# Altium project PCB_Project.PrjPcb
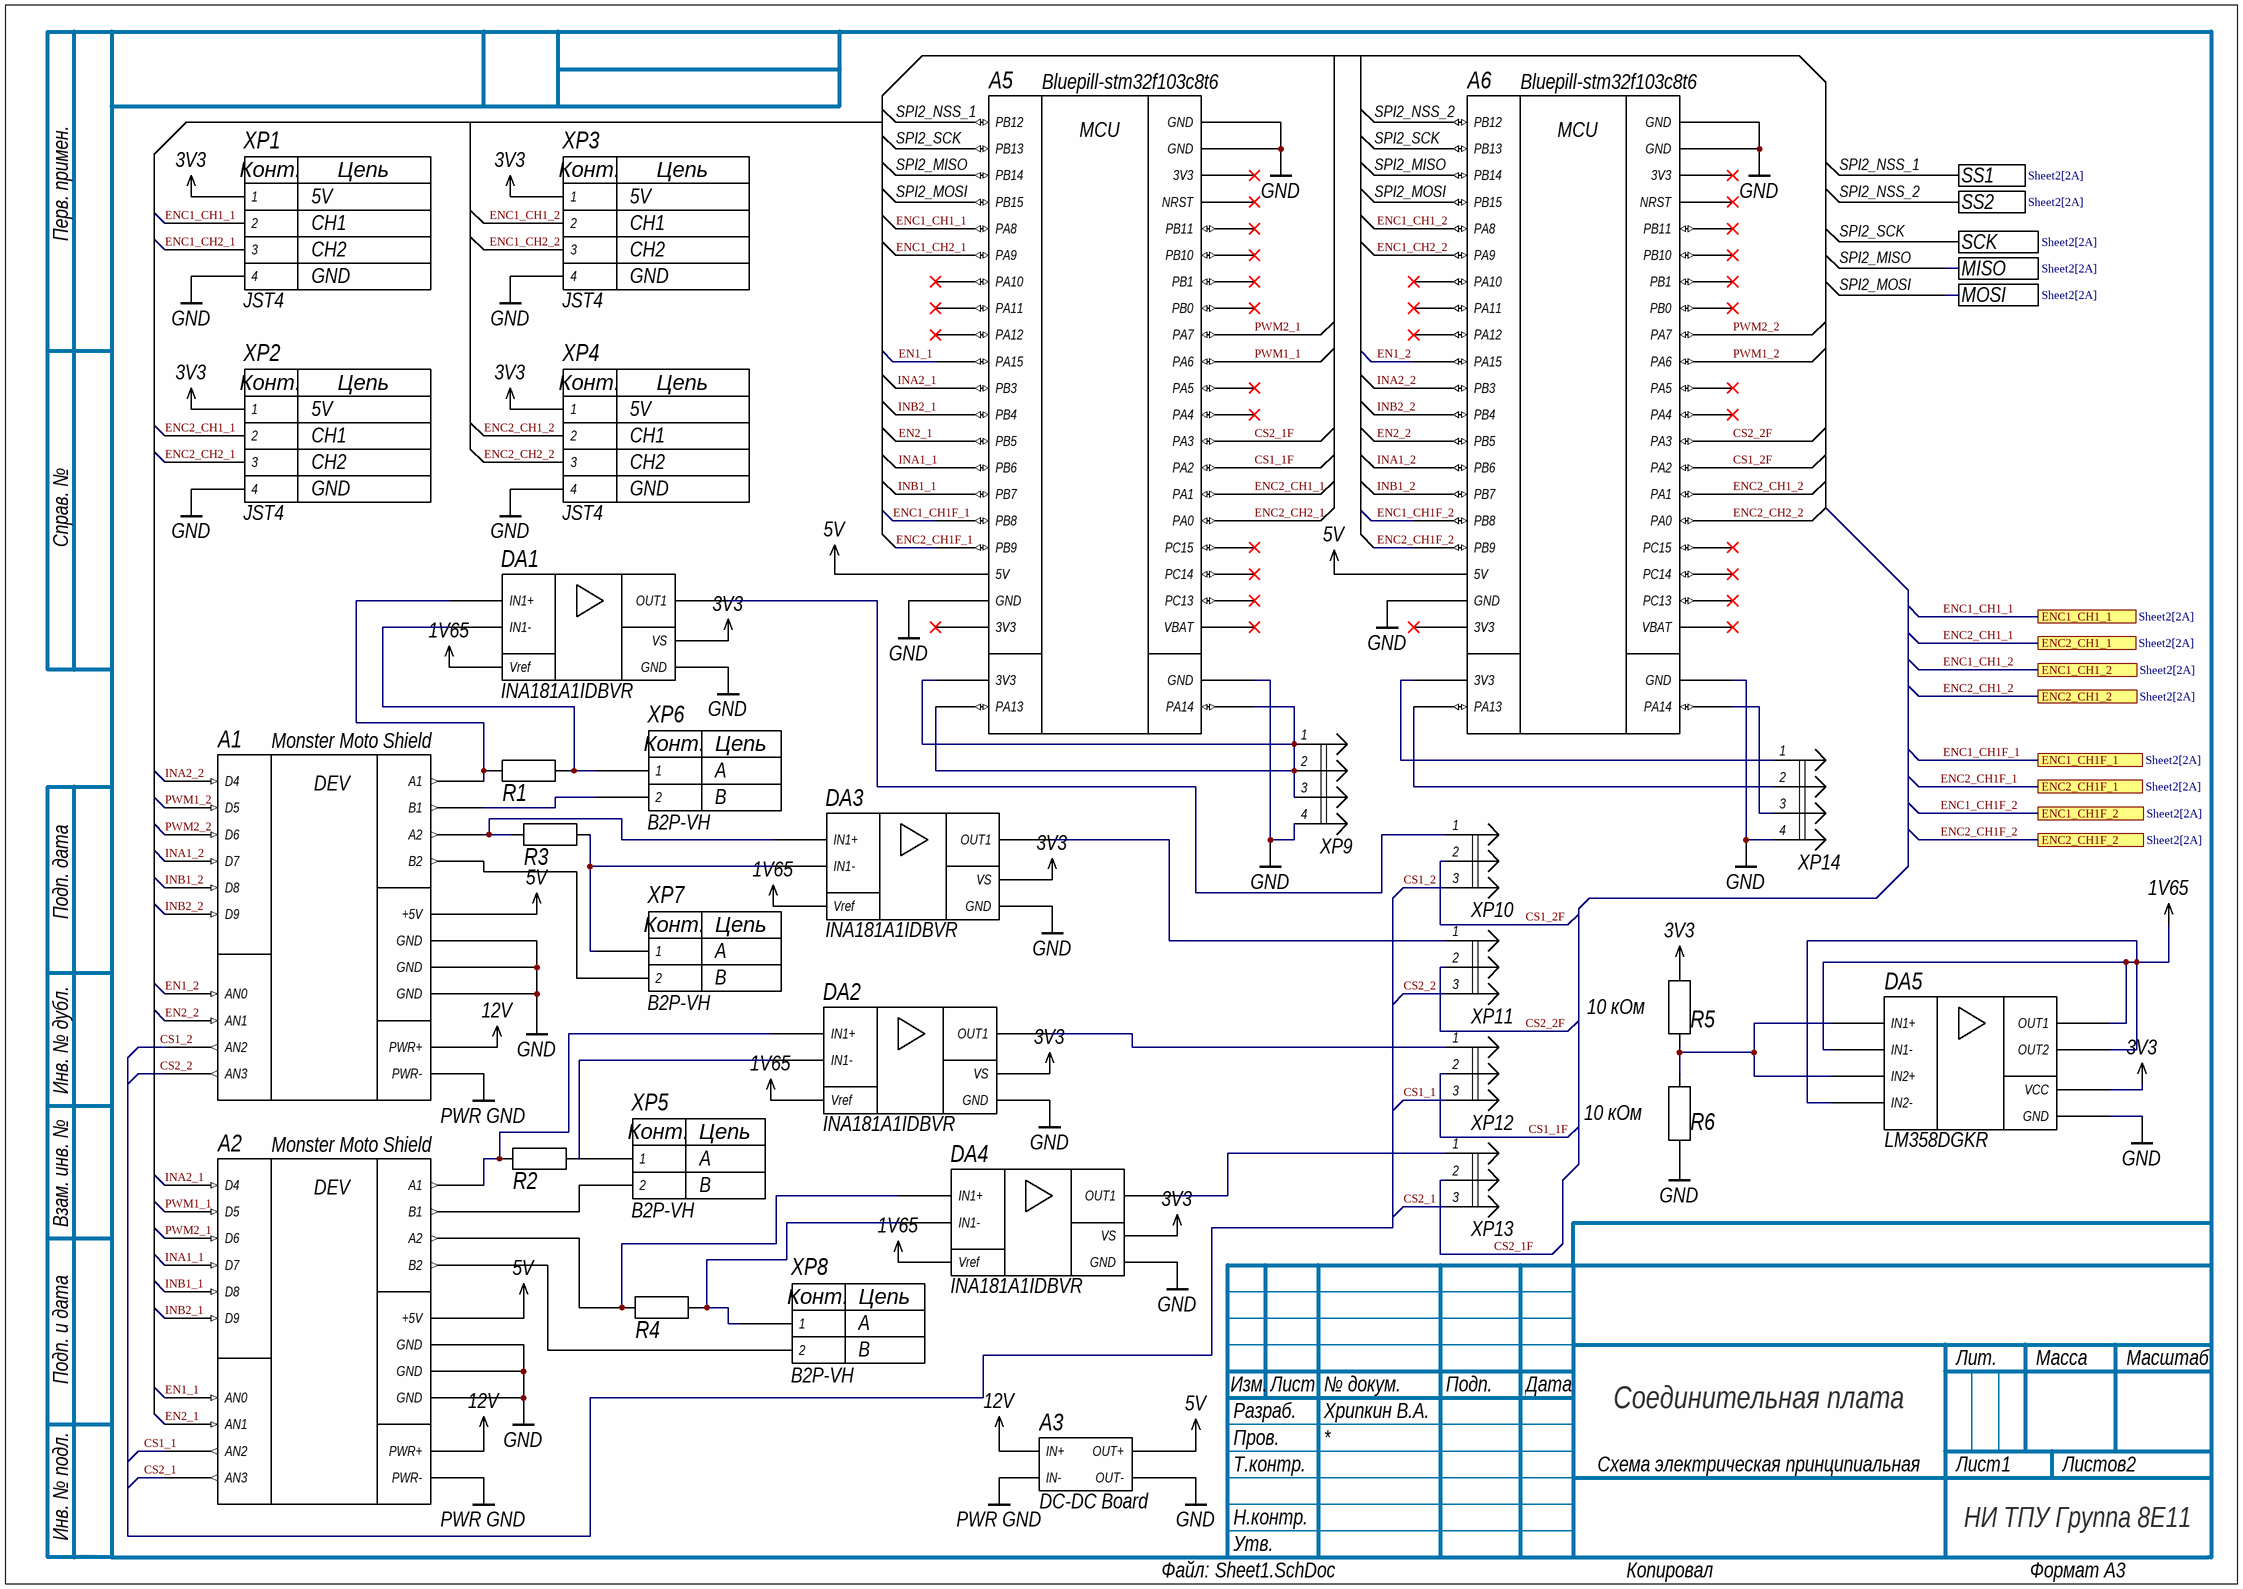
[diagram p0: Sheet1.SchDoc]
2 sheets, 62 parts. Net scope: flat (ports and power ports of the same name join across sheets).
Board file: PCB1.PcbDoc
Sheets:
  Sheet1.SchDoc
  Sheet2.SchDoc

## Sheet Sheet1.SchDoc
size 420 x 297 mm; Author: ALTIUM GOSTBOM2.0 KEV; SheetNumber: 1; SheetTotal: 2; п_Разраб_Р: Хрипкин В.А.; Наименование_организации: НИ ТПУ Группа 8Е11; Наименование2: Соединительная плата; Вид_документа_SCH: Схема электрическая принципиальная

### Parts
A1  Monster Moto Shield  [Monster Moto Shield]
A2  Monster Moto Shield  [Monster Moto Shield]
A3  DC-DC Board  [DC-DC Board]
A5  Bluepill-stm32f103c8t6  [BluePill]
A6  Bluepill-stm32f103c8t6  [BluePill]
DA1  INA181A1IDBVR  [SOT236]
DA2  INA181A1IDBVR  [SOT236]
DA3  INA181A1IDBVR  [SOT236]
DA4  INA181A1IDBVR  [SOT236]
DA5  LM358DGKR  [VSSOP-8]
R1  ва  [R1210]  (value not drawn)
R2  ва  [R1210]  (value not drawn)
R3  ва  [R1210]  (value not drawn)
R4  ва  [R1210]  (value not drawn)
R5  ва  [R0603]  (value not drawn)
R6  ва  [R0603]  (value not drawn)
XP1  JST4  [JST 4pin]
XP2  JST4  [JST 4pin]
XP3  JST4  [JST 4pin]
XP4  JST4  [JST 4pin]
XP5  B2P-VH  [B2P-VH]
XP6  B2P-VH  [B2P-VH]
XP7  B2P-VH  [B2P-VH]
XP8  B2P-VH  [B2P-VH]
XP9  (no value)  [PLS-4]
XP10  (no value)  [PLS-3]
XP11  (no value)  [PLS-3]
XP12  (no value)  [PLS-3]
XP13  (no value)  [PLS-3]
XP14  (no value)  [PLS-4]

### Ports
ENC1_CH1_1 (see Sheet2[2A]), ENC1_CH1_2 (see Sheet2[2A]), ENC1_CH1F_1 (see Sheet2[2A]), ENC1_CH1F_2 (see Sheet2[2A]), ENC2_CH1_1 (see Sheet2[2A]), ENC2_CH1_2 (see Sheet2[2A]), ENC2_CH1F_1 (see Sheet2[2A]), ENC2_CH1F_2 (see Sheet2[2A]), MISO (see Sheet2[2A]), MOSI (see Sheet2[2A]), SCK (see Sheet2[2A]), SS1 (see Sheet2[2A]), SS2 (see Sheet2[2A])

### Nets
1V65: DA1.1(Vref) DA2.1(Vref) DA3.1(Vref) DA4.1(Vref) DA5.1(OUT1) DA5.2(IN1-) DA5.6(IN2-) DA5.7(OUT2)
3V3: DA1.3(VS) DA2.3(VS) DA3.3(VS) DA4.3(VS) DA5.8(VCC) R5.2 XP1.1 XP2.1 XP3.1 XP4.1
5V: A1.19(+5V) A2.19(+5V) A3.3(OUT+) A5.18(5V) A6.18(5V)
12V: A1.20(PWR+) A2.20(PWR+) A3.1(IN+)
GND: A1.16(GND) A1.17(GND) A1.18(GND) A2.16(GND) A2.17(GND) A2.18(GND) A3.4(OUT-) A5.19(GND) A5.21(GND) A5.22(GND) A5.44(GND) A6.19(GND) A6.21(GND) A6.22(GND) A6.44(GND) DA1.2(GND) DA2.2(GND) DA3.2(GND) DA4.2(GND) DA5.4(GND) R6.1 XP1.4 XP2.4 XP3.4 XP4.4 XP9.4 XP14.4
PWR GND: A1.21(PWR-) A2.21(PWR-) A3.2(IN-)
CS1_1: A2.3(AN2) XP12.3
CS1_1F: A5.34(PA2) XP12.2
CS1_2: A1.3(AN2) XP10.3
CS1_2F: A6.34(PA2) XP10.2
CS2_1: A2.4(AN3) XP13.3
CS2_1F: A5.33(PA3) XP13.2
CS2_2: A1.4(AN3) XP11.3
CS2_2F: A6.33(PA3) XP11.2
EN1_1: A2.1(AN0) A5.10(PA15)
EN1_2: A1.1(AN0) A6.10(PA15)
EN2_1: A2.2(AN1) A5.13(PB5)
EN2_2: A1.2(AN1) A6.13(PB5)
ENC1_CH1_1: A5.5(PA8) XP1.2 ; port ENC1_CH1_1
ENC1_CH1_2: A6.5(PA8) XP3.2 ; port ENC1_CH1_2
ENC1_CH1F_1: A5.16(PB8) ; port ENC1_CH1F_1
ENC1_CH1F_2: A6.16(PB8) ; port ENC1_CH1F_2
ENC1_CH2_1: A5.6(PA9) XP1.3
ENC1_CH2_2: A6.6(PA9) XP3.3
ENC2_CH1_1: A5.35(PA1) XP2.2 ; port ENC2_CH1_1
ENC2_CH1_2: A6.35(PA1) XP4.2 ; port ENC2_CH1_2
ENC2_CH1F_1: A5.17(PB9) ; port ENC2_CH1F_1
ENC2_CH1F_2: A6.17(PB9) ; port ENC2_CH1F_2
ENC2_CH2_1: A5.36(PA0) XP2.3
ENC2_CH2_2: A6.36(PA0) XP4.3
INA1_1: A2.8(D7) A5.14(PB6)
INA1_2: A1.8(D7) A6.14(PB6)
INA2_1: A2.5(D4) A5.11(PB3)
INA2_2: A1.5(D4) A6.11(PB3)
INB1_1: A2.9(D8) A5.15(PB7)
INB1_2: A1.9(D8) A6.15(PB7)
INB2_1: A2.10(D9) A5.12(PB4)
INB2_2: A1.10(D9) A6.12(PB4)
PWM1_1: A2.6(D5) A5.30(PA6)
PWM1_2: A1.6(D5) A6.30(PA6)
PWM2_1: A2.7(D6) A5.29(PA7)
PWM2_2: A1.7(D6) A6.29(PA7)
SPI2_MISO: A5.3(PB14) A6.3(PB14) ; port MISO
SPI2_MOSI: A5.4(PB15) A6.4(PB15) ; port MOSI
SPI2_NSS_1: A5.1(PB12) ; port SS1
SPI2_NSS_2: A6.1(PB12) ; port SS2
SPI2_SCK: A5.2(PB13) A6.2(PB13) ; port SCK
NetA1_11: A1.11(A1) DA1.4(IN1+) R1.2
NetA1_12: A1.12(B1) XP6.2
NetA1_13: A1.13(A2) DA3.4(IN1+) R3.2
NetA1_14: A1.14(B2) XP7.2
NetA2_11: A2.11(A1) DA2.4(IN1+) R2.2
NetA2_12: A2.12(B1) XP5.2
NetA2_13: A2.13(A2) DA4.4(IN1+) R4.2
NetA2_14: A2.14(B2) XP8.2
NetA5_41: A5.41(3V3) A5.42(PA13) A5.43(PA14) XP9.1 XP9.2 XP9.3
NetA6_41: A6.41(3V3) XP14.1
NetA6_42: A6.42(PA13) XP14.2
NetA6_43: A6.43(PA14) XP14.3
NetDA1_5: DA1.5(IN1-) R1.1 XP6.1
NetDA1_6: DA1.6(OUT1) XP10.1
NetDA2_5: DA2.5(IN1-) R2.1 XP5.1
NetDA2_6: DA2.6(OUT1) XP12.1
NetDA3_5: DA3.5(IN1-) R3.1 XP7.1
NetDA3_6: DA3.6(OUT1) XP11.1
NetDA4_5: DA4.5(IN1-) R4.1 XP8.1
NetDA4_6: DA4.6(OUT1) XP13.1
NetDA5_3: DA5.3(IN1+) DA5.5(IN2+) R5.1 R6.2

Not connected (* = marked no-connect by the designer): A5 7(PA10)* 8(PA11)* 9(PA12)* 20(3V3)* 23(3V3)* 24(NRST)* 25(PB11)* 26(PB10)* 27(PB1)* 28(PB0)* 31(PA5)* 32(PA4)* 37(PC15)* 38(PC14)* 39(PC13)* 40(VBAT)*; A6 7(PA10)* 8(PA11)* 9(PA12)* 20(3V3)* 23(3V3)* 24(NRST)* 25(PB11)* 26(PB10)* 27(PB1)* 28(PB0)* 31(PA5)* 32(PA4)* 37(PC15)* 38(PC14)* 39(PC13)* 40(VBAT)*

### Notes on the sheet
- (near R5) 10 кОм
- (near R6) 10 кОм
- Перв. примен.
- Справ. №
- Подп. дата
- Инв. № дубл.
- Взам. инв. №
- Подп. и дата
- Изм.
- Разраб.
- Лист
- № докум.
- Подп.
- Дата
- Лит.
- Масса
- Масштаб
- Пров.
- Т.контр.
- Листов
- Инв. № подл.
- Н.контр.
- Утв.
- ALTIUM GOSTBOM2.0 KEV
- Файл:
- Копировал
- Формат А3
- (in symbol BluePill) MCU
- (in symbol JST4) Конт.; Цепь; 5V; CH1; CH2; GND
- (in symbol JST VH(B2P-VH)) Конт.; Цепь; A; B
- (in symbol MonsterMotoShield) DEV

### Library data of the parts
A1 A2 = MonsterMotoShield: Драйвер двигателей Monster Moto Shield построен на базе чипа VNH2SP30, что позволяет управлять, как скоростью движения, так и направлением подключённых двигателей, а так же блокировать моторы и считывать ток потребления, используя аналоговые выводы Arduino.
A3 = DC-DC: Преобразователь напряжений 12-5В
A5 A6 = BluePill: Отладочная плата на основе микроконтроллера stm32f103c8t6
DA1-DA4 = INA181A1IDBVR: Усилители операционные, дифференциальные, инструментальные, Gain 20, SOT236
DA5 = LM358DGKR: Операционный усилитель, Двойной, 700 кГц, 0.3 В/мкс, 3В до 32В, ± 1.5В до ± 16В, [VSSOP-8]
R1-R4 = Resisitor: Резистор постоянный
R5 R6 = R1_POSTOYANNYJ_W0.5: Резистор постоянный
XP5-XP8 = JST VH(B2P-VH)
XP9 XP14 = Connector-4: PLS4
XP10-XP13 = Connector-3: PLS3

## Sheet Sheet2.SchDoc
size 420 x 297 mm; Author: ALTIUM GOSTBOM2.0 KEV; SheetNumber: 2; SheetTotal: 2
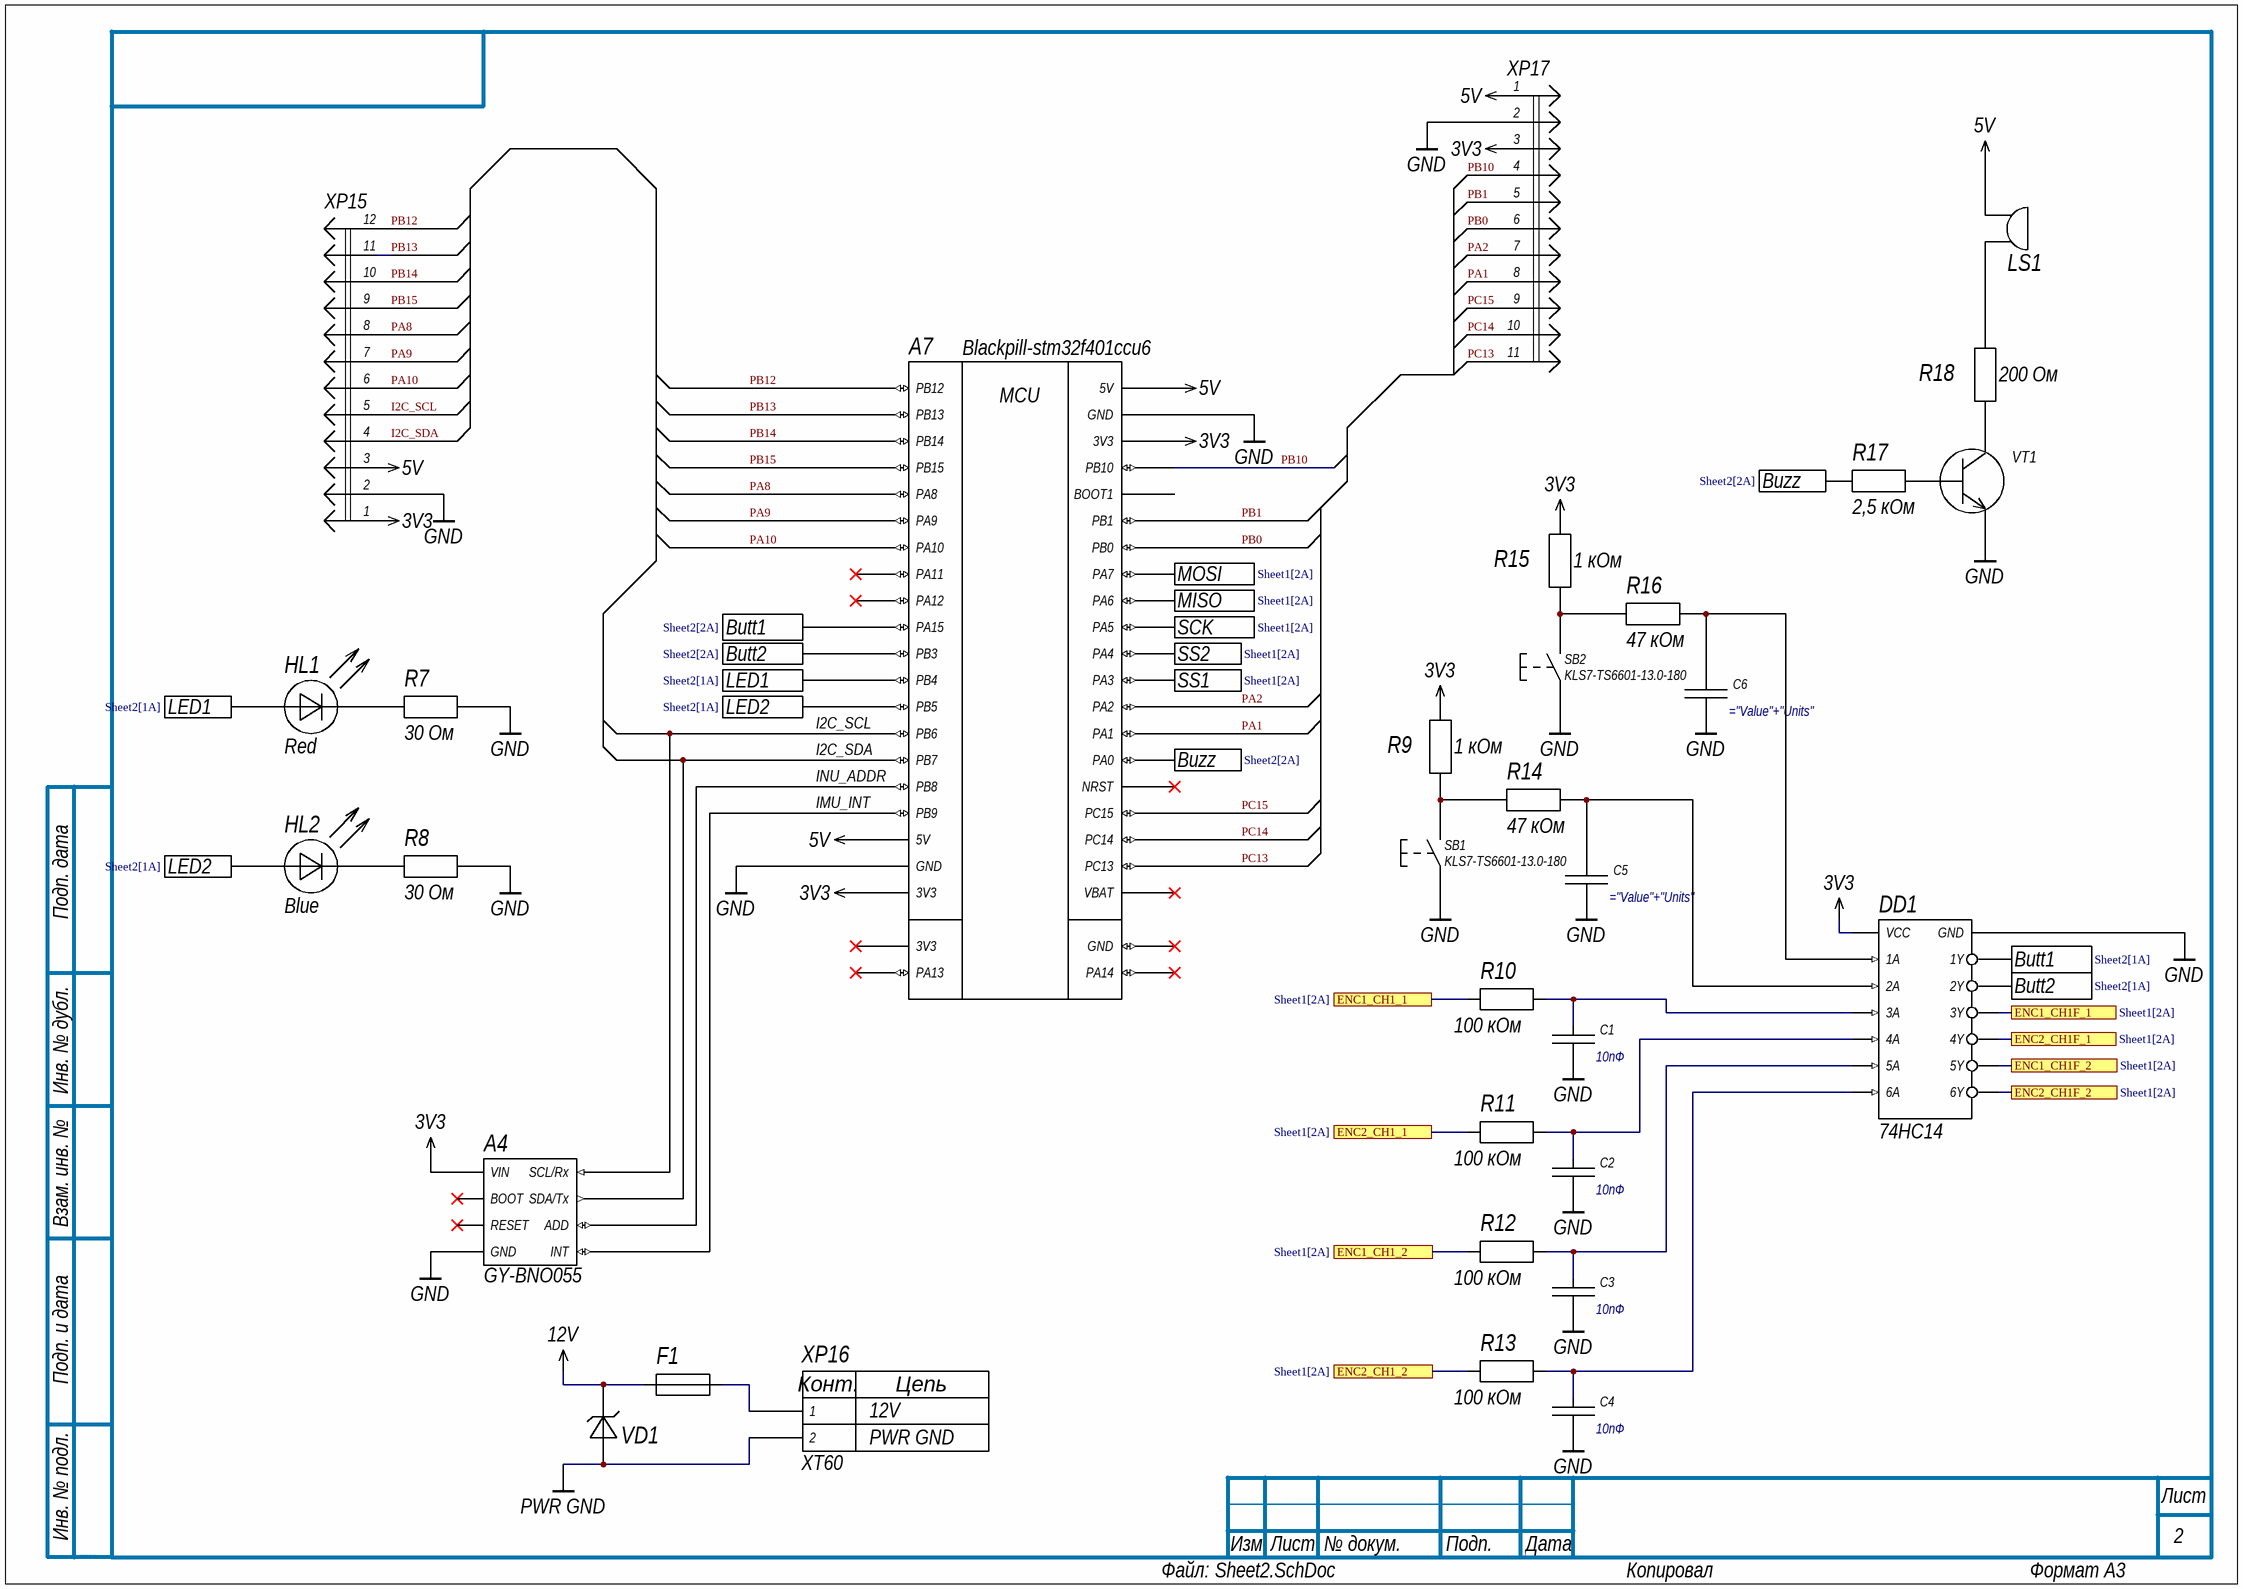
[diagram p1: Sheet2.SchDoc]

### Parts
A4  GY-BNO055  [GY-BNO055 board]
A7  Blackpill-stm32f401ccu6  [BluePill]
C1  10пФ  [C0603C]
C2  10пФ  [C0603C]
C3  10пФ  [C0603C]
C4  10пФ  [C0603C]
C5  (no value)  [C0603C]
C6  (no value)  [C0603C]
DD1  74HC14  [SO-14]
F1  ва  [BLX-A]  (value not drawn)
HL1  Обозначение при заказе  [ledrad3mm]  (value not drawn)
HL2  Обозначение при заказе  [ledrad3mm]  (value not drawn)
LS1  Обозначение при заказе  [Buzzer 12mm]  (value not drawn)
R7  ва  [R0603]  (value not drawn)
R8  ва  [R0603]  (value not drawn)
R9  ва  [R0603]  (value not drawn)
R10  ва  [R0603]  (value not drawn)
R11  ва  [R0603]  (value not drawn)
R12  ва  [R0603]  (value not drawn)
R13  ва  [R0603]  (value not drawn)
R14  ва  [R0603]  (value not drawn)
R15  ва  [R0603]  (value not drawn)
R16  ва  [R0603]  (value not drawn)
R17  ва  [R0603]  (value not drawn)
R18  ва  [R1210]  (value not drawn)
SB1  KLS7-TS6601-13.0-180  [Button]
SB2  KLS7-TS6601-13.0-180  [Button]
VD1  Диод защитный  [SMB]  (value not drawn)
VT1  (no value)  [SOT23-3-BEC]
XP15  (no value)  [PLS-12]
XP16  XT60  [XT60UPB-M]
XP17  (no value)  [PLS-11]

### Ports
Butt1 (see Sheet2[1A]), Butt1 (see Sheet2[2A]), Butt2 (see Sheet2[1A]), Butt2 (see Sheet2[2A]), Buzz (see Sheet2[2A]), ENC1_CH1_1 (see Sheet1[2A]), ENC1_CH1_2 (see Sheet1[2A]), ENC1_CH1F_1 (see Sheet1[2A]), ENC1_CH1F_2 (see Sheet1[2A]), ENC2_CH1_1 (see Sheet1[2A]), ENC2_CH1_2 (see Sheet1[2A]), ENC2_CH1F_1 (see Sheet1[2A]), ENC2_CH1F_2 (see Sheet1[2A]), LED1 (see Sheet2[1A]), LED2 (see Sheet2[1A]), MISO (see Sheet1[2A]), MOSI (see Sheet1[2A]), SCK (see Sheet1[2A]), SS1 (see Sheet1[2A]), SS2 (see Sheet1[2A])

### Nets
3V3: A4.8(VIN) A7.20(3V3) A7.23(3V3) DD1.14(VCC) R9.1 R15.1 XP15.1 XP17.3
5V: A7.18(5V) A7.21(5V) LS1.1 XP15.3 XP17.1
12V: F1.1 VD1.2
GND: A4.7(GND) A7.19(GND) A7.22(GND) C1.2 C2.2 C3.2 C4.2 C5.2 C6.2 DD1.7(GND) R7.2 R8.2 SB1.1(S1) SB2.1(S1) VT1.E XP15.2 XP17.2
PWR GND: VD1.1 XP16.2
ENC1_CH1_1: R10.1 ; port ENC1_CH1_1
ENC1_CH1_2: R12.1 ; port ENC1_CH1_2
ENC1_CH1F_1: DD1.6(3Y) ; port ENC1_CH1F_1
ENC1_CH1F_2: DD1.10(5Y) ; port ENC1_CH1F_2
ENC2_CH1_1: R11.1 ; port ENC2_CH1_1
ENC2_CH1_2: R13.1 ; port ENC2_CH1_2
ENC2_CH1F_1: DD1.8(4Y) ; port ENC2_CH1F_1
ENC2_CH1F_2: DD1.12(6Y) ; port ENC2_CH1F_2
I2C_SCL: A4.6(SCL/Rx) A7.14(PB6) XP15.5
I2C_SDA: A4.5(SDA/Tx) A7.15(PB7) XP15.4
IMU_INT: A4.3(INT) A7.17(PB9)
INU_ADDR: A4.4(ADD) A7.16(PB8)
PA1: A7.34(PA1) XP17.8
PA2: A7.33(PA2) XP17.7
PA8: A7.5(PA8) XP15.8
PA9: A7.6(PA9) XP15.7
PA10: A7.7(PA10) XP15.6
PB0: A7.27(PB0) XP17.6
PB1: A7.26(PB1) XP17.5
PB10: A7.24(PB10) XP17.4
PB12: A7.1(PB12) XP15.12
PB13: A7.2(PB13) XP15.11
PB14: A7.3(PB14) XP15.10
PB15: A7.4(PB15) XP15.9
PC13: A7.39(PC13) XP17.11
PC14: A7.38(PC14) XP17.10
PC15: A7.37(PC15) XP17.9
SPI2_MISO: A7.29(PA6) ; port MISO
SPI2_MOSI: A7.28(PA7) ; port MOSI
SPI2_NSS_1: A7.32(PA3) ; port SS1
SPI2_NSS_2: A7.31(PA4) ; port SS2
SPI2_SCK: A7.30(PA5) ; port SCK
NetA7_10: A7.10(PA15) DD1.2(1Y) ; port Butt1
NetA7_11: A7.11(PB3) DD1.4(2Y) ; port Butt2
NetA7_12: A7.12(PB4) HL1.1(A) ; port LED1
NetA7_13: A7.13(PB5) HL2.1(A) ; port LED2
NetA7_35: A7.35(PA0) R17.1 ; port Buzz
NetC1_1: C1.1 DD1.5(3A) R10.2
NetC2_1: C2.1 DD1.9(4A) R11.2
NetC3_1: C3.1 DD1.11(5A) R12.2
NetC4_1: C4.1 DD1.13(6A) R13.2
NetC5_1: C5.1 DD1.3(2A) R14.2
NetC6_1: C6.1 DD1.1(1A) R16.2
NetF1_2: F1.2 XP16.1
NetHL1_2: HL1.2(C) R7.1
NetHL2_2: HL2.2(C) R8.1
NetLS1_2: LS1.2 R18.2
NetR9_2: R9.2 R14.1 SB1.2(S2)
NetR15_2: R15.2 R16.1 SB2.2(S2)
NetR17_2: R17.2 VT1.B
NetR18_1: R18.1 VT1.C

Not connected (* = marked no-connect by the designer): A4 1(RESET)* 2(BOOT)*; A7 8(PA11)* 9(PA12)* 25(BOOT1) 36(NRST)* 40(VBAT)* 41(3V3)* 42(PA13)* 43(PA14)* 44(GND)*

### Notes on the sheet
- (near R18) 200 Ом
- (near VT1) 2,5 кОм
- (near R15) 1 кОм
- (near R16) 47 кОм
- (near HL1) Red
- (near R7) 30 Ом
- (near R9) 1 кОм
- (near R14) 47 кОм
- (near HL2) Blue
- (near R8) 30 Ом
- (near R10) 100 кОм
- (near R11) 100 кОм
- (near R12) 100 кОм
- (near R13) 100 кОм
- Подп. дата
- Инв. № дубл.
- Взам. инв. №
- Подп. и дата
- Инв. № подл.
- Изм.
- Лист
- № докум.
- Подп.
- Дата
- ALTIUM GOSTBOM2.0 KEV
- Файл:
- Копировал
- Формат А3
- (in symbol BlackPill) MCU
- (in symbol XT60) Конт.; Цепь; 12V; PWR GND

### Library data of the parts
A4 = GY-BNO055: Девятиосный датчик инерциальной навигации
A7 = BlackPill: Отладочная плата на основе микроконтроллера stm32f401ccu6
C1-C4 = Capasitor: Конденсатор 0603; Value: 10; Units: пФ
C5 C6 = Capasitor: Конденсатор 0603
DD1 = 74HC14: Инвертирующий гестерезисный триггер Шмитта (SO14)
F1 = Fuse: Предохранитель плавкий
HL1 HL2 = LED: LED 3мм
LS1 = Buzzer: Зуммер 5В (D=12мм)
R7-R17 = R1_POSTOYANNYJ_W0.5: Резистор постоянный
R18 = Resisitor: Резистор постоянный
SB1 SB2 = Button: Тактовая кнопка 6x6 мм; Part number: KLS7-TS6601-13.0-180
VD1 = Diode TVS
VT1 = BCR112E6327HTSA1: NPN Биполярный транзистор (SOT23)
XP15 = Connector-12: PLS12
XP17 = Connector-11: PLS11

## Nets that join several sheets
3V3: Sheet1 (10 pins), Sheet2 (8 pins)
5V: Sheet1 (5 pins), Sheet2 (5 pins)
12V: Sheet1 (A1.20 A2.20 A3.1), Sheet2 (F1.1 VD1.2)
GND: Sheet1 (27 pins), Sheet2 (17 pins)
PWR GND: Sheet1 (A1.21 A2.21 A3.2), Sheet2 (VD1.1 XP16.2)
ENC1_CH1_1: Sheet1 (A5.5 XP1.2), Sheet2 (R10.1)
ENC1_CH1_2: Sheet1 (A6.5 XP3.2), Sheet2 (R12.1)
ENC1_CH1F_1: Sheet1 (A5.16), Sheet2 (DD1.6)
ENC1_CH1F_2: Sheet1 (A6.16), Sheet2 (DD1.10)
ENC2_CH1_1: Sheet1 (A5.35 XP2.2), Sheet2 (R11.1)
ENC2_CH1_2: Sheet1 (A6.35 XP4.2), Sheet2 (R13.1)
ENC2_CH1F_1: Sheet1 (A5.17), Sheet2 (DD1.8)
ENC2_CH1F_2: Sheet1 (A6.17), Sheet2 (DD1.12)
SPI2_MISO: Sheet1 (A5.3 A6.3), Sheet2 (A7.29)
SPI2_MOSI: Sheet1 (A5.4 A6.4), Sheet2 (A7.28)
SPI2_NSS_1: Sheet1 (A5.1), Sheet2 (A7.32)
SPI2_NSS_2: Sheet1 (A6.1), Sheet2 (A7.31)
SPI2_SCK: Sheet1 (A5.2 A6.2), Sheet2 (A7.30)